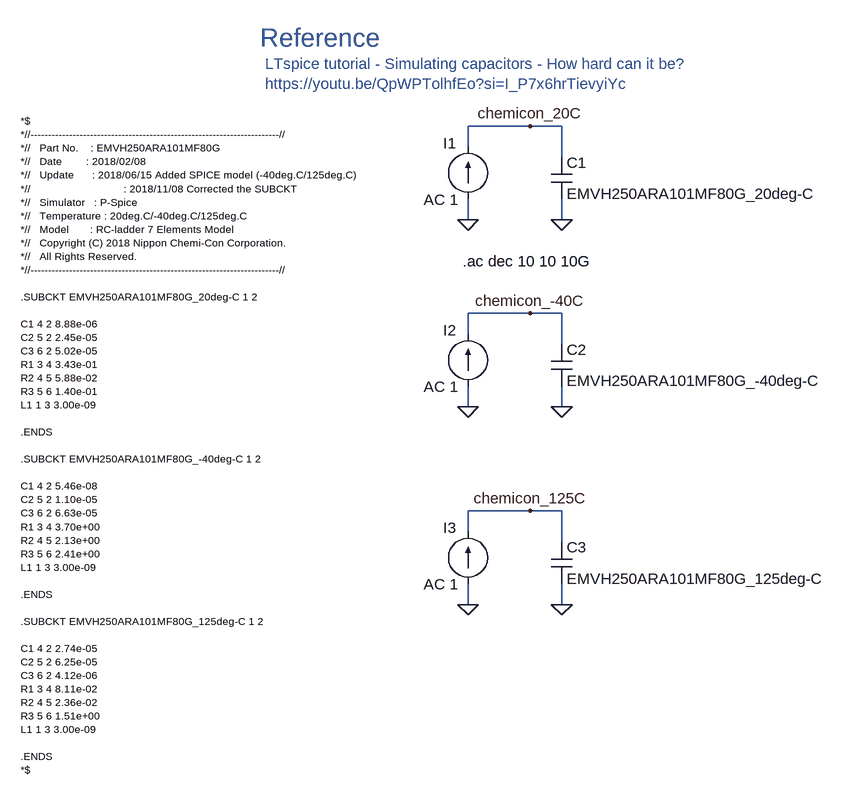
[diagram p0: schematic 05-EMVH250ARA101MF80G_impedance.asc]
05-EMVH250ARA101MF80G_impedance.asc, the LTspice schematic file:
Version 4
SHEET 1 980 1420
WIRE 512 336 416 336
WIRE 560 336 512 336
WIRE 416 368 416 336
WIRE 560 384 560 336
WIRE 416 480 416 448
WIRE 560 480 560 448
WIRE 512 624 416 624
WIRE 560 624 512 624
WIRE 416 656 416 624
WIRE 560 672 560 624
WIRE 416 768 416 736
WIRE 560 768 560 736
WIRE 512 928 416 928
WIRE 560 928 512 928
WIRE 416 960 416 928
WIRE 560 976 560 928
WIRE 416 1072 416 1040
WIRE 560 1072 560 1040
FLAG 416 480 0
FLAG 560 480 0
FLAG 512 336 chemicon_20C
FLAG 416 768 0
FLAG 560 768 0
FLAG 512 624 chemicon_-40C
FLAG 416 1072 0
FLAG 560 1072 0
FLAG 512 928 chemicon_125C
SYMBOL current 416 448 R180
WINDOW 0 18 86 Left 2
WINDOW 3 24 0 Left 2
WINDOW 123 15 -1 Left 2
WINDOW 39 0 0 Left 0
SYMATTR InstName I1
SYMATTR Value ""
SYMATTR Value2 AC 1
SYMBOL cap 544 384 R0
SYMATTR InstName C1
SYMATTR Value EMVH250ARA101MF80G_20deg-C
SYMATTR Prefix X
SYMBOL current 416 736 R180
WINDOW 0 18 86 Left 2
WINDOW 3 24 0 Left 2
WINDOW 123 15 -1 Left 2
WINDOW 39 0 0 Left 0
SYMATTR InstName I2
SYMATTR Value ""
SYMATTR Value2 AC 1
SYMBOL cap 544 672 R0
SYMATTR InstName C2
SYMATTR Value EMVH250ARA101MF80G_-40deg-C
SYMATTR Prefix X
SYMBOL current 416 1040 R180
WINDOW 0 18 86 Left 2
WINDOW 3 24 0 Left 2
WINDOW 123 15 -1 Left 2
WINDOW 39 0 0 Left 0
SYMATTR InstName I3
SYMATTR Value ""
SYMATTR Value2 AC 1
SYMBOL cap 544 976 R0
SYMATTR InstName C3
SYMATTR Value EMVH250ARA101MF80G_125deg-C
SYMATTR Prefix X
TEXT -272 328 Left 1 !*$\n*//-----------------------------------------------------------------------//\n*//   Part No.    : EMVH250ARA101MF80G\n*//   Date        : 2018/02/08\n*//   Update      : 2018/06/15 Added SPICE model (-40deg.C/125deg.C)\n*//                               : 2018/11/08 Corrected the SUBCKT\n*//   Simulator   : P-Spice\n*//   Temperature : 20deg.C/-40deg.C/125deg.C\n*//   Model       : RC-ladder 7 Elements Model\n*//   Copyright (C) 2018 Nippon Chemi-Con Corporation.\n*//   All Rights Reserved.\n*//-----------------------------------------------------------------------//\n \n.SUBCKT EMVH250ARA101MF80G_20deg-C 1 2\n \nC1 4 2 8.88e-06\nC2 5 2 2.45e-05\nC3 6 2 5.02e-05\nR1 3 4 3.43e-01\nR2 4 5 5.88e-02\nR3 5 6 1.40e-01\nL1 1 3 3.00e-09\n \n.ENDS\n \n.SUBCKT EMVH250ARA101MF80G_-40deg-C 1 2\n \nC1 4 2 5.46e-08\nC2 5 2 1.10e-05\nC3 6 2 6.63e-05\nR1 3 4 3.70e+00\nR2 4 5 2.13e+00\nR3 5 6 2.41e+00\nL1 1 3 3.00e-09\n \n.ENDS\n \n.SUBCKT EMVH250ARA101MF80G_125deg-C 1 2\n \nC1 4 2 2.74e-05\nC2 5 2 6.25e-05\nC3 6 2 4.12e-06\nR1 3 4 8.11e-02\nR2 4 5 2.36e-02\nR3 5 6 1.51e+00\nL1 1 3 3.00e-09\n \n.ENDS\n*$
TEXT 408 544 Left 2 !.ac dec 10 10 10G
TEXT 104 240 Left 2 ;LTspice tutorial - Simulating capacitors - How hard can it be?\nhttps://youtu.be/QpWPTolhfEo?si=I_P7x6hrTievyiYc
TEXT 96 200 Left 4 ;Reference

The netlist it stands for:
* 05-EMVH250ARA101MF80G_impedance.asc
I1 0 chemicon_20C AC 1
XC1 chemicon_20C 0 EMVH250ARA101MF80G_20deg-C  ; pins A B
I2 0 chemicon_-40C AC 1
XC2 chemicon_-40C 0 EMVH250ARA101MF80G_-40deg-C  ; pins A B
I3 0 chemicon_125C AC 1
XC3 chemicon_125C 0 EMVH250ARA101MF80G_125deg-C  ; pins A B
*$
*//-----------------------------------------------------------------------//
*//   Part No.    : EMVH250ARA101MF80G
*//   Date        : 2018/02/08
*//   Update      : 2018/06/15 Added SPICE model (-40deg.C/125deg.C)
*//                               : 2018/11/08 Corrected the SUBCKT
*//   Simulator   : P-Spice
*//   Temperature : 20deg.C/-40deg.C/125deg.C
*//   Model       : RC-ladder 7 Elements Model
*//   Copyright (C) 2018 Nippon Chemi-Con Corporation.
*//   All Rights Reserved.
*//-----------------------------------------------------------------------//
.SUBCKT EMVH250ARA101MF80G_20deg-C 1 2
C1 4 2 8.88e-06
C2 5 2 2.45e-05
C3 6 2 5.02e-05
R1 3 4 3.43e-01
R2 4 5 5.88e-02
R3 5 6 1.40e-01
L1 1 3 3.00e-09
.ENDS
.SUBCKT EMVH250ARA101MF80G_-40deg-C 1 2
C1 4 2 5.46e-08
C2 5 2 1.10e-05
C3 6 2 6.63e-05
R1 3 4 3.70e+00
R2 4 5 2.13e+00
R3 5 6 2.41e+00
L1 1 3 3.00e-09
.ENDS
.SUBCKT EMVH250ARA101MF80G_125deg-C 1 2
C1 4 2 2.74e-05
C2 5 2 6.25e-05
C3 6 2 4.12e-06
R1 3 4 8.11e-02
R2 4 5 2.36e-02
R3 5 6 1.51e+00
L1 1 3 3.00e-09
.ENDS
*$
.ac dec 10 10 10G
* LTspice tutorial - Simulating capacitors - How hard can it be?
* https://youtu.be/QpWPTolhfEo?si=I_P7x6hrTievyiYc
* Reference
.backanno
.end

* Results of the author's LTspice run, read from the files saved beside the schematic
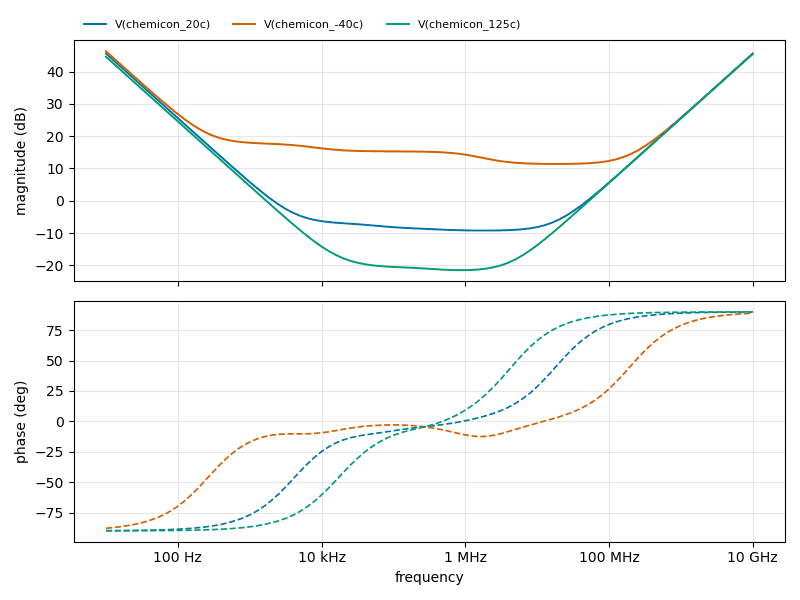
[diagram p1: AC Analysis of 05-EMVH250ARA101MF80G_impedance.asc, plotted from the saved traces]
* AC Analysis, 1 run:
*   V(chemicon_20c): 45.59 dB at 10 Hz, 45.51 dB at 10 GHz, peak 45.59 dB at 10 Hz, 3 dB below the peak at 14.14 Hz
*   V(chemicon_-40c): 46.27 dB at 10 Hz, 45.51 dB at 10 GHz, peak 46.27 dB at 10 Hz, 3 dB below the peak at 14.15 Hz
*   V(chemicon_125c): 44.57 dB at 10 Hz, 45.51 dB at 10 GHz, peak 45.51 dB at 10 GHz, 3 dB below the peak at 7.071 GHz